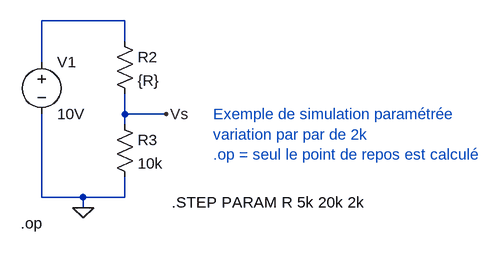
[diagram p0: schematic pontdiv.asc]
pontdiv.asc, the LTspice schematic file:
Version 4
SHEET 1 880 680
WIRE 128 -16 0 -16
WIRE 128 16 128 -16
WIRE 0 48 0 -16
WIRE 128 128 128 96
WIRE 192 128 128 128
WIRE 128 144 128 128
WIRE 0 256 0 128
WIRE 64 256 0 256
WIRE 128 256 128 224
WIRE 128 256 64 256
WIRE 64 272 64 256
FLAG 64 272 0
FLAG 192 128 Vs
SYMBOL res 112 0 R0
SYMATTR InstName R2
SYMATTR Value {R}
SYMBOL res 112 128 R0
SYMATTR InstName R3
SYMATTR Value 10k
SYMBOL voltage 0 32 R0
SYMATTR InstName V1
SYMATTR Value 10V
TEXT -32 296 Left 2 !.op
TEXT 200 264 Left 2 !.STEP PARAM R 5k 20k 2k
TEXT 264 128 Left 2 ;Exemple de simulation paramétrée\nvariation par par de 2k\n.op = seul le point de repos est calculé

The netlist it stands for:
* pontdiv.asc
R2 N001 Vs {R}
R3 Vs 0 10k
V1 N001 0 10V
.op
.STEP PARAM R 5k 20k 2k
* Exemple de simulation paramétrée
* variation par par de 2k
* .op = seul le point de repos est calculé
.backanno
.end

* Results of the author's LTspice run, read from the files saved beside the schematic
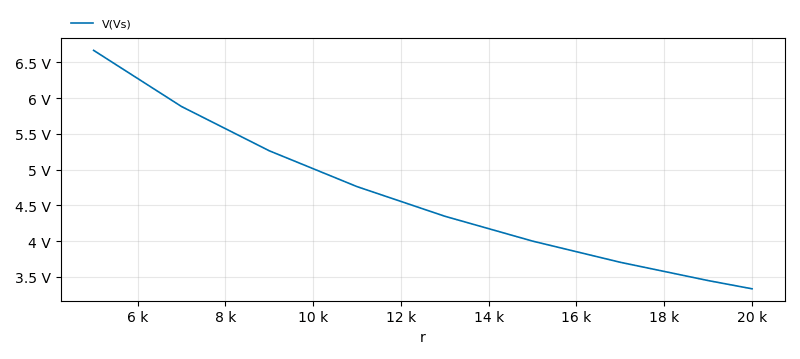
[diagram p1: Operating Point of pontdiv.asc, plotted from the saved traces]
* Operating Point, 1 run:
*   V(Vs): 6.667 V at r=5 k, 3.333 V at r=20 k, min 3.333 V, max 6.667 V